# Altium schematic sheet IR Transmitter.SchDoc
size A4; SheetNumber: 5; SheetTotal: 7
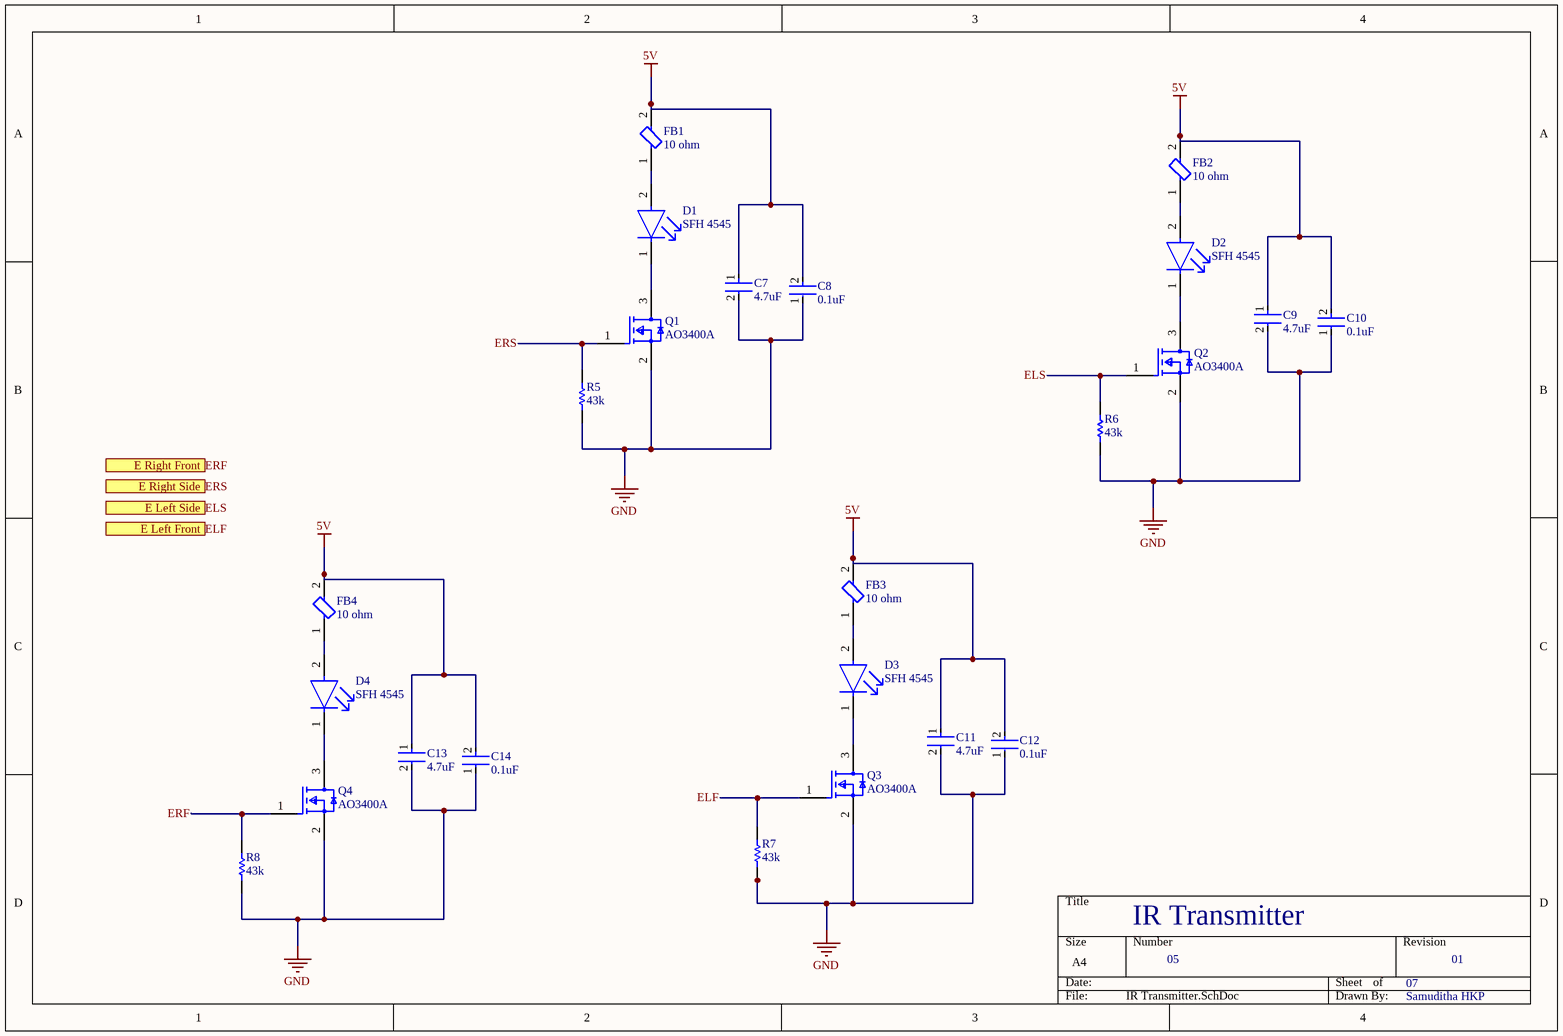
[diagram p0: IR Transmitter.SchDoc]

## Parts
C7  4.7uF  [FP-GRM155-0_1-IPC_B]
C8  0.1uF  [FP-GRM15-MFG]
C9  4.7uF  [FP-GRM155-0_1-IPC_B]
C10  0.1uF  [FP-GRM15-MFG]
C11  4.7uF  [FP-GRM155-0_1-IPC_B]
C12  0.1uF  [FP-GRM15-MFG]
C13  4.7uF  [FP-GRM155-0_1-IPC_B]
C14  0.1uF  [FP-GRM15-MFG]
D1  SFH 4545  [FP-SFH_4556-MFG]
D2  SFH 4545  [FP-SFH_4556-MFG]
D3  SFH 4545  [FP-SFH_4556-MFG]
D4  SFH 4545  [FP-SFH_4556-MFG]
FB1  10 ohm  [FP-BLM15-0_05-MFG]
FB2  10 ohm  [FP-BLM15-0_05-MFG]
FB3  10 ohm  [FP-BLM15-0_05-MFG]
FB4  10 ohm  [FP-BLM15-0_05-MFG]
Q1  AO3400A  [FP-SOT23-MFG]
Q2  AO3400A  [FP-SOT23-MFG]
Q3  AO3400A  [FP-SOT23-MFG]
Q4  AO3400A  [FP-SOT23-MFG]
R5  43k  [RESC1005X40X25NL05T05]
R6  43k  [RESC1005X40X25NL05T05]
R7  43k  [RESC1005X40X25NL05T05]
R8  43k  [RESC1005X40X25NL05T05]

## Ports
E Left Front (in, see Main[3C], MCU[4B]), E Left Side (in, see Main[3C], MCU[4B]), E Right Front (in, see Main[3C], MCU[4B]), E Right Side (in, see Main[3C], MCU[4B])

## Nets
5V: C7.1 C8.2 C9.1 C10.2 C11.1 C12.2 C13.1 C14.2 FB1.2 FB2.2 FB3.2 FB4.2
GND: C7.2 C8.1 C9.2 C10.1 C11.2 C12.1 C13.2 C14.1 Q1.2(S) Q2.2(S) Q3.2(S) Q4.2(S) R5.1 R6.1 R7.1 R8.1
ELF: Q3.1(G) R7.2 ; port E Left Front
ELS: Q2.1(G) R6.2 ; port E Left Side
ERF: Q4.1(G) R8.2 ; port E Right Front
ERS: Q1.1(G) R5.2 ; port E Right Side
NetD1_1: D1.1(C) Q1.3(D)
NetD1_2: D1.2(A) FB1.1
NetD2_1: D2.1(C) Q2.3(D)
NetD2_2: D2.2(A) FB2.1
NetD3_1: D3.1(C) Q3.3(D)
NetD3_2: D3.2(A) FB3.1
NetD4_1: D4.1(C) Q4.3(D)
NetD4_2: D4.2(A) FB4.1

## Notes on the sheet
- IR Transmitter
- 05
- 07
- 01
- Samuditha HKP

## Library data of the parts
C7 C9 C11 C13 = CMP-2008-04549-2: Chip Multilayer Ceramic Capacitors for General Purpose, 0402, 4.7uF, X5R, 15%, 20%, 6.3V; Height: 0.5mm; Weight: 0.000212oz; Length: 1mm; Case Code (Metric): 1005; Packaging: Tape and Reel; Termination: SMD/SMT; Dielectric: X5R; Depth: 0.5mm; Case Code (Imperial): 0402; Min Operating Temperature: -55°C; Case/Package: 0402; Voltage: 6.3V; Width: 0.02inch; Capacitance: 4.7uF; Lead Free: Lead Free; Thickness: 0.022inch; Contact Plating: Tin; REACH SVHC: No SVHC; Package Quantity: 10000; Tolerance: 20%; Voltage Rating (DC): 6.3V; Voltage Rating: 6.3V; Mount: Surface Mount; Max Operating Temperature: 85°C
C8 C10 C12 C14 = CMP-2100-03641-2: CAP CER 0.1UF 16V X7R 0402; Manufacturer Part Number: GRM155R71C104KA88D; Manufacturer: Murata; Standoff Height: 0mm; Tolerance: 10%; Voltage Rating: 16Vdc; Material: Ceramic; Capacitance: 0.10μF; Value: 0.10μF; RoHS: TRUE; Temperature Characteristic: X7R; Octopart: https://octopart.com/grm155r71c104ka88d-murata-196880; Digikey Description: CAP CER 0.1UF 16V X7R 0402; Device Class L3: Ceramic Capacitors; Height: 0.55mm; ComponentLink2Description: Datasheet; Temperature Range Low: -55°C; Ipc Land Pattern Name: CAPC10050X219; ComponentLink2URL: https://search.murata.co.jp/Ceramy/image/img/A01X/G101/ENG/GRM155R71H471KA01-01A.pdf; Device Class L1: Passive Components; Lead Free: yes; Category: Cap; Package: GRM15; Temperature: -55°C to +125°C; Device Class L2: Capacitors; Temperature Range High: +125°C; Mouser Description: 0402 0.1 uF 16V ±10 % Tolerance X7R SMT Multilayer Ceramic Capacitor
D1-D4 = CMP-62016-000017-1: EMITTER IR 860NM 100MA RADIAL; Manufacturer: Osram Opto; Colour: Infrared; Viewing Angle: 40°; Reverse Voltage: 12V; Led Orientation: Straight; Forward Voltage: 1.5V; Automotive: No; Octopart: https://octopart.com/sfh+4556-osram+opto-31094094; ComponentLink2URL: https://dammedia.osram.info/media/resource/hires/osram-dam-2496340/SFH%204556.pdf; Temperature: -40°C to +100°C; Device Class L1: Optoelectronics; RoHS: TRUE; Manufacturer Part Number: SFH 4556; Peak Emmision Wavelength: 860nm; Temperature Range Low: -40°C; Device Class L2: LEDs; Package: SFH 4556; ComponentLink2Description: Datasheet; Device Class L3: unset; Digikey Description: EMITTER IR 860NM 100MA RADIAL; Forward Current: 100mA; Mouser Description: SFH 4556 Osram Opto, 860nm IR LED, 5mm (T-1 3/4) Through Hole package; Lead Free: Yes; Temperature Range High: +100°C; Category: Diode
FB1-FB4 = CMP-0686-00305-4: Chip Ferrite Bead, 0402, 10Ω @ 100MHz, 0.1Ω, 25%, 300mA; Impedance: 10R; DC Resistance (DCR): 100mR; Number of Circuits: 1; Shielding: Unshielded; Material: Ferrite; Max Operating Temperature: 125°C; REACH SVHC: No SVHC; Package Quantity: 1; Resistor Type: Ferrite Bead; Max Current Rating: 300mA; Min Operating Temperature: -55°C; Termination: SMD/SMT; Case Code (Imperial): 0402; Series: BLM15B; Case Code (Metric): 1005; Core Material: Ferrite; DC Resistance-Max: 100mR; Case/Package: 0402; Number of Lines: 1; Height: 0.5mm; Current Rating: 300mA; Resistance: 100mR; Width: 0.5mm; Test Frequency: 100MHz; Length: 1mm; Depth: 0.5mm; Max DC Current: 300mA; Number of Pins: 2; Lead Free: Lead Free; Tolerance: 25%; Packaging: Tape and Reel
Q1-Q4 = CMP-83955-000006-1: MOSFET N-CH 30V 5.7A SOT23; Input Capacitance: 630pF; Number of Elements: 1; Rds On Max: 26.5mR; Max Power Dissipation: 1.4W; Gate to Source Voltage (Vgs): 12V; Min Operating Temperature: -55°C; Lead Free: Lead Free; Number of Pins: 3; Drain to Source Voltage (Vdss): 30V; Case/Package: SOT-23; Mount: Surface Mount; Continuous Drain Current (ID): 5.7A; Radiation Hardening: No; Packaging: Tape and Reel; Max Operating Temperature: 150°C; Power Dissipation: 1.4W
R5-R8 = CMP-2002-00002-1: Part Number: CRCW040243K0FKED; Manufacturer: Vishay Dale